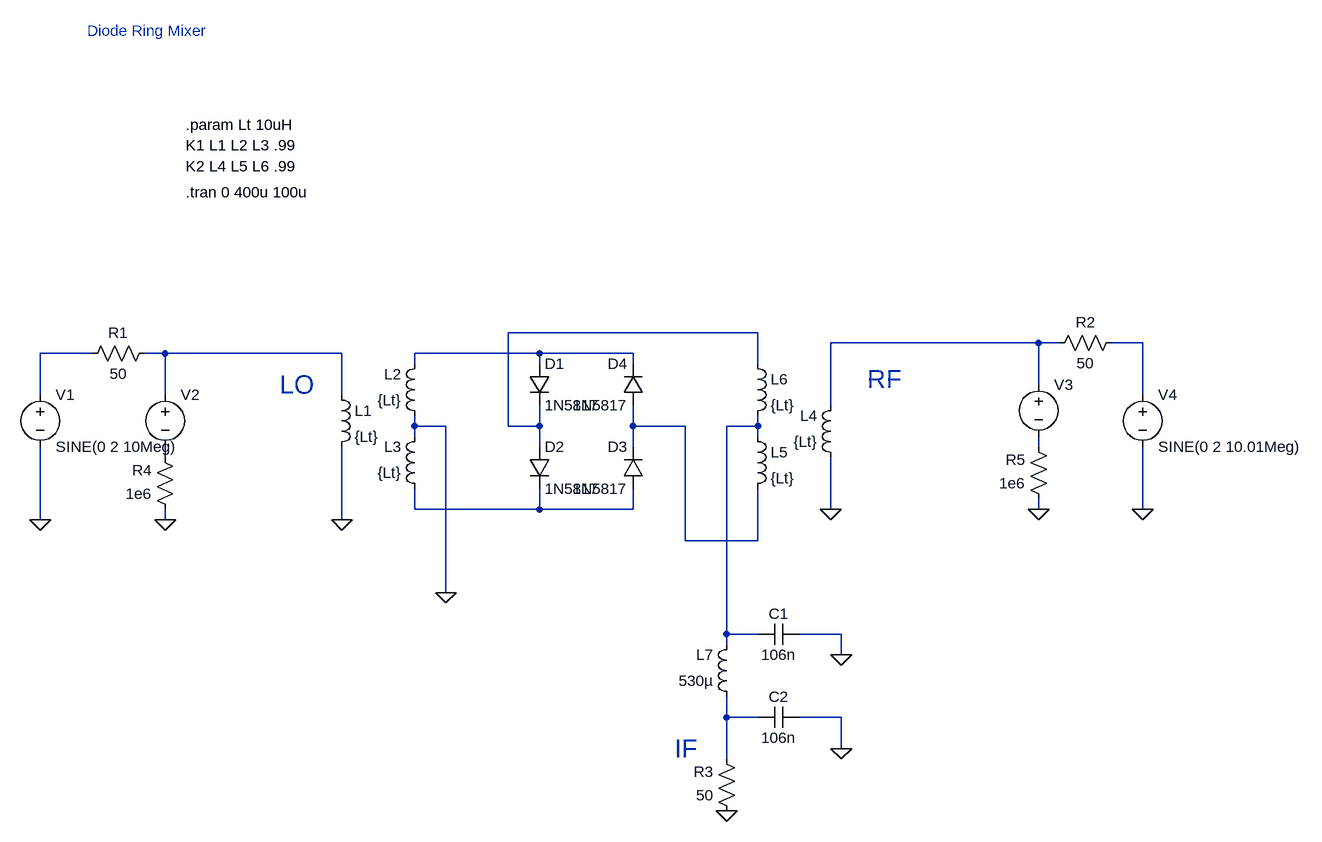
[diagram p0: schematic Draft1.asc]
Draft1.asc, the LTspice schematic file:
Version 4
SHEET 1 1688 800
WIRE 848 48 464 48
WIRE 1280 64 960 64
WIRE 1312 64 1280 64
WIRE 1440 64 1392 64
WIRE -176 80 -256 80
WIRE -64 80 -96 80
WIRE 208 80 -64 80
WIRE 512 80 320 80
WIRE 656 80 512 80
WIRE 320 96 320 80
WIRE 512 96 512 80
WIRE 656 96 656 80
WIRE 848 96 848 48
WIRE 1280 128 1280 64
WIRE -256 144 -256 80
WIRE -64 144 -64 80
WIRE 208 144 208 80
WIRE 1440 144 1440 64
WIRE 960 160 960 64
WIRE 320 192 320 176
WIRE 368 192 320 192
WIRE 464 192 464 48
WIRE 512 192 512 160
WIRE 512 192 464 192
WIRE 656 192 656 160
WIRE 736 192 656 192
WIRE 848 192 848 176
WIRE 848 192 800 192
WIRE 320 208 320 192
WIRE 848 208 848 192
WIRE 512 224 512 192
WIRE 656 224 656 192
WIRE 1280 224 1280 208
WIRE -64 240 -64 224
WIRE 320 320 320 288
WIRE 512 320 512 288
WIRE 512 320 320 320
WIRE 656 320 656 288
WIRE 656 320 512 320
WIRE 960 320 960 240
WIRE 1280 320 1280 304
WIRE 1440 320 1440 224
WIRE -256 336 -256 224
WIRE -64 336 -64 320
WIRE 208 336 208 224
WIRE 736 368 736 192
WIRE 848 368 848 288
WIRE 848 368 736 368
WIRE 368 448 368 192
WIRE 800 512 800 192
WIRE 848 512 800 512
WIRE 976 512 912 512
WIRE 800 528 800 512
WIRE 976 544 976 512
WIRE 800 640 800 608
WIRE 848 640 800 640
WIRE 976 640 912 640
WIRE 976 688 976 640
WIRE 800 704 800 640
FLAG 1280 320 0
FLAG 1440 320 0
FLAG -64 336 0
FLAG -256 336 0
FLAG 208 336 0
FLAG 960 320 0
FLAG 368 448 0
FLAG 800 784 0
FLAG 976 688 0
FLAG 976 544 0
SYMBOL ind 192 128 R0
SYMATTR InstName L1
SYMATTR Value {Lt}
SYMBOL ind 336 192 R180
WINDOW 0 36 80 Left 2
WINDOW 3 36 40 Left 2
SYMATTR InstName L2
SYMATTR Value {Lt}
SYMBOL ind 336 304 R180
WINDOW 0 36 80 Left 2
WINDOW 3 36 40 Left 2
SYMATTR InstName L3
SYMATTR Value {Lt}
SYMBOL diode 496 96 R0
SYMATTR InstName D1
SYMATTR Value 1N5817
SYMBOL diode 496 224 R0
SYMATTR InstName D2
SYMATTR Value 1N5817
SYMBOL diode 672 288 R180
WINDOW 0 24 64 Left 2
WINDOW 3 24 0 Left 2
SYMATTR InstName D3
SYMATTR Value 1N5817
SYMBOL diode 672 160 R180
WINDOW 0 24 64 Left 2
WINDOW 3 24 0 Left 2
SYMATTR InstName D4
SYMATTR Value 1N5817
SYMBOL ind 976 256 R180
WINDOW 0 36 80 Left 2
WINDOW 3 36 40 Left 2
SYMATTR InstName L4
SYMATTR Value {Lt}
SYMBOL ind 832 192 R0
SYMATTR InstName L5
SYMATTR Value {Lt}
SYMBOL ind 832 80 R0
SYMATTR InstName L6
SYMATTR Value {Lt}
SYMBOL voltage -256 128 R0
SYMATTR InstName V1
SYMATTR Value SINE(0 2 10Meg)
SYMATTR Value2 AC 2
SYMBOL voltage -64 128 R0
SYMATTR InstName V2
SYMATTR Value ""
SYMATTR Value2 AC 1
SYMBOL voltage 1280 112 R0
SYMATTR InstName V3
SYMATTR Value ""
SYMATTR Value2 AC 1
SYMBOL voltage 1440 128 R0
SYMATTR InstName V4
SYMATTR Value SINE(0 2 10.01Meg)
SYMBOL res -80 64 R90
WINDOW 0 0 56 VBottom 2
WINDOW 3 32 56 VTop 2
SYMATTR InstName R1
SYMATTR Value 50
SYMBOL res 1408 48 R90
WINDOW 0 0 56 VBottom 2
WINDOW 3 32 56 VTop 2
SYMATTR InstName R2
SYMATTR Value 50
SYMBOL res 816 800 R180
WINDOW 0 36 76 Left 2
WINDOW 3 36 40 Left 2
SYMATTR InstName R3
SYMATTR Value 50
SYMBOL res -48 336 R180
WINDOW 0 36 76 Left 2
WINDOW 3 36 40 Left 2
SYMATTR InstName R4
SYMATTR Value 1e6
SYMBOL res 1296 320 R180
WINDOW 0 36 76 Left 2
WINDOW 3 36 40 Left 2
SYMATTR InstName R5
SYMATTR Value 1e6
SYMBOL cap 912 496 R90
WINDOW 0 0 32 VBottom 2
WINDOW 3 32 32 VTop 2
SYMATTR InstName C1
SYMATTR Value 106n
SYMBOL cap 912 624 R90
WINDOW 0 0 32 VBottom 2
WINDOW 3 32 32 VTop 2
SYMATTR InstName C2
SYMATTR Value 106n
SYMBOL ind 816 624 R180
WINDOW 0 36 80 Left 2
WINDOW 3 36 40 Left 2
SYMATTR InstName L7
SYMATTR Value 530µ
TEXT -32 -240 Left 2 !K1 L1 L2 L3 .99
TEXT -32 -208 Left 2 !K2 L4 L5 L6 .99
TEXT 1016 120 Left 4 ;RF
TEXT 112 128 Left 4 ;LO
TEXT 720 688 Left 4 ;IF
TEXT -184 -416 Left 2 ;Diode Ring Mixer
TEXT -32 -272 Left 2 !.param Lt 10uH
TEXT -32 -168 Left 2 !.tran 0 400u 100u

The netlist it stands for:
* Draft1.asc
L1 N005 0 {Lt}
L2 0 N006 {Lt}
L3 N011 0 {Lt}
D1 N006 N001 1N5817
D2 N001 N011 1N5817
D3 N011 N007 1N5817
D4 N007 N006 1N5817
L4 0 N002 {Lt}
L5 N008 N007 {Lt}
L6 N001 N008 {Lt}
V1 N004 0 SINE(0 2 10Meg) AC 2
V2 N005 N010 AC 1
V3 N002 N009 AC 1
V4 N003 0 SINE(0 2 10.01Meg)
R1 N005 N004 50
R2 N003 N002 50
R3 0 N012 50
R4 0 N010 1e6
R5 0 N009 1e6
C1 0 N008 106n
C2 0 N012 106n
L7 N012 N008 530µ
.model D D
.lib standard.dio
K1 L1 L2 L3 .99
K2 L4 L5 L6 .99
* RF
* LO
* IF
* Diode Ring Mixer
.param Lt 10uH
.tran 0 400u 100u
.backanno
.end